# Altium project Current Sensor.PrjPCB
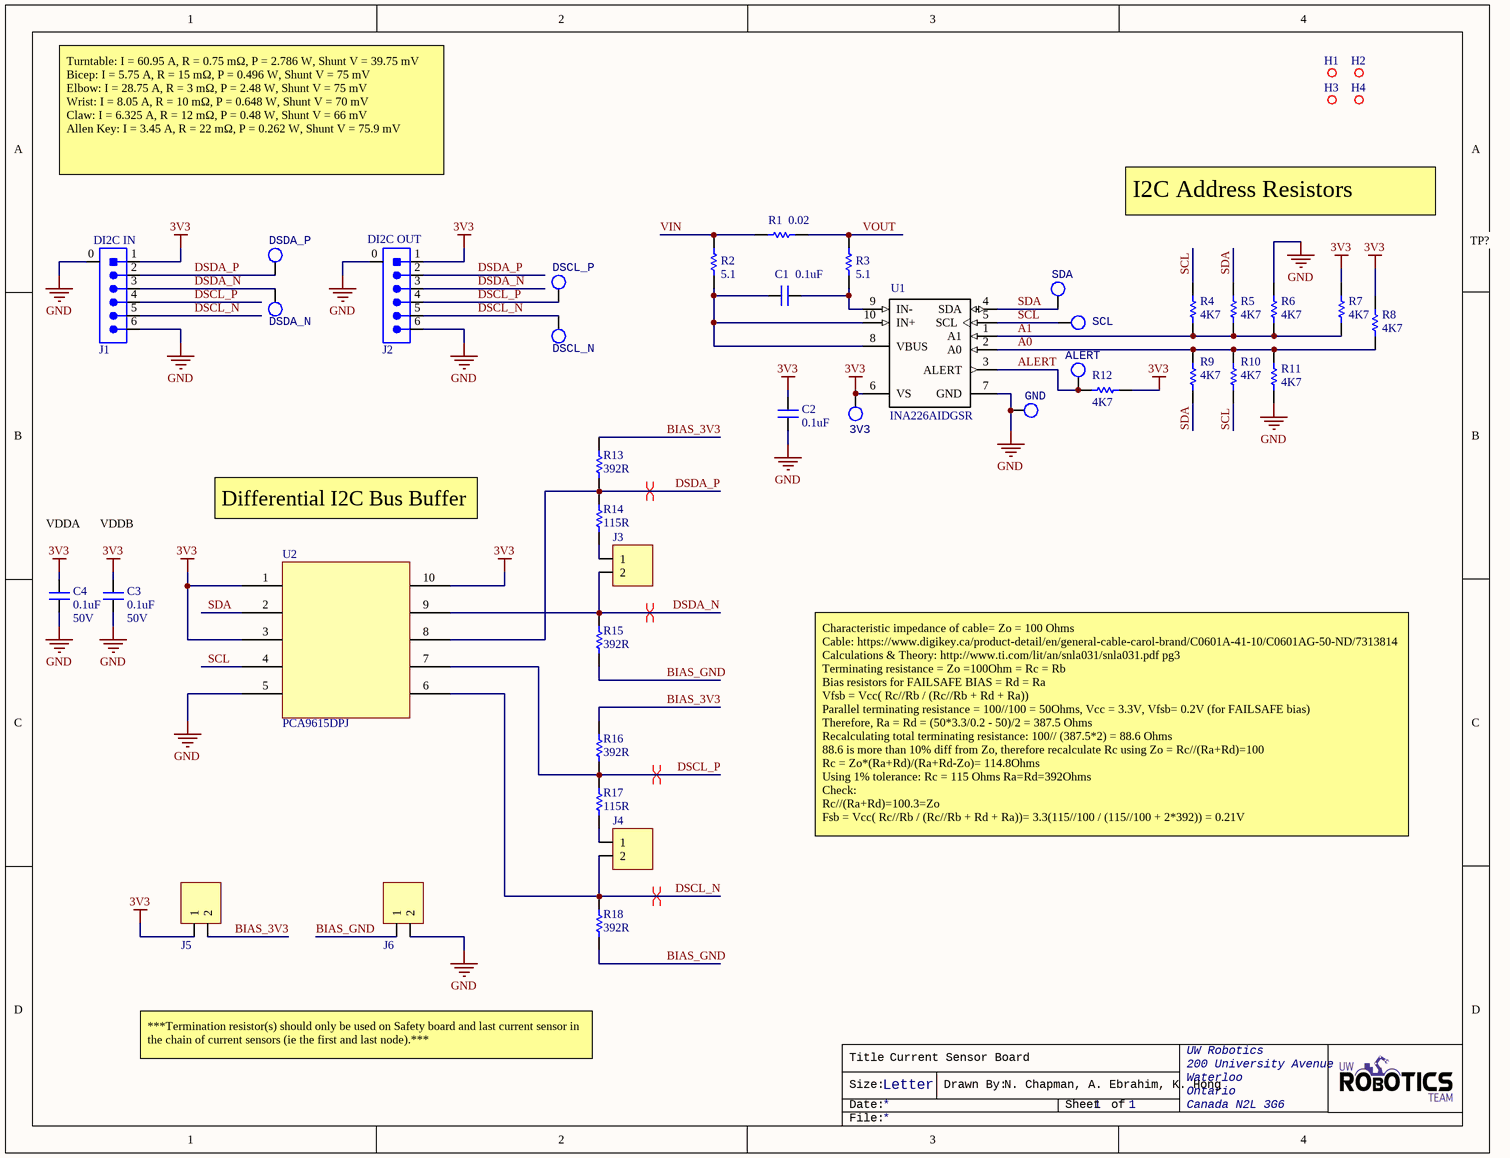
[diagram p0: Current Sensor.SchDoc]
Address1: 200 University Avenue; Address2: Waterloo; Address3: Ontario; Address4: Canada N2L 3G6; BoardName: Your Board Name; DrawnBy: Your Name
1 sheet, 43 parts. Net scope: global (net labels, ports and power ports of the same name join across sheets).
Board file: Current Sensor.PcbDoc

## Sheet Current Sensor.SchDoc: Current Sensor Board
size Letter; DrawnBy: N. Chapman, A. Ebrahim, K. Hong; Organization: UW Robotics; Address1: 200 University Avenue; Address2: Waterloo; Address3: Ontario; Address4: Canada N2L 3G6; Revision: A; SheetNumber: 1; SheetTotal: 1

### Parts
C1  value 0.1uF  [CAPC2012X140N]  (hidden comment: CAP_0.1uF_50V_0805)
C2  value 0.1uF  [CAPC2012X140N]  (hidden comment: CAP_0.1uF_50V_0805)
C3  value 0.1uF  Voltage Rating: 50V  [CAPC2012X140N]  (hidden comment: CAP_0.1uF_50V_0805)
C4  value 0.1uF  Voltage Rating: 50V  [CAPC2012X140N]  (hidden comment: CAP_0.1uF_50V_0805)
H1  MOUNTING_HOLES  [MOUNTING_HOLE]  (value not drawn)
H2  MOUNTING_HOLES  [MOUNTING_HOLE]  (value not drawn)
H3  MOUNTING_HOLES  [MOUNTING_HOLE]  (value not drawn)
H4  MOUNTING_HOLES  [MOUNTING_HOLE]  (value not drawn)
J1  DI2C IN  [MOLEX-5024940670]
J2  DI2C OUT  [MOLEX-5024940670]
J3  JUMPER_2  [HDR1X2]  (value not drawn)
J4  JUMPER_2  [HDR1X2]  (value not drawn)
J5  JUMPER_2  [HDR1X2]  (value not drawn)
J6  JUMPER_2  [HDR1X2]  (value not drawn)
R1  value 0.02  [RESC6532X75N]  (hidden comment: RES_20m_2512)
R2  value 5.1  [RESC2013X70X40LL20T20]  (hidden comment: RES_5.1_0805)
R3  value 5.1  [RESC2013X70X40LL20T20]  (hidden comment: RES_5.1_0805)
R4  value 4K7  [RESC2012X60N]  (hidden comment: RES_4K7_0805)
R5  value 4K7  [RESC2012X60N]  (hidden comment: RES_4K7_0805)
R6  value 4K7  [RESC2012X60N]  (hidden comment: RES_4K7_0805)
R7  value 4K7  [RESC2012X60N]  (hidden comment: RES_4K7_0805)
R8  value 4K7  [RESC2012X60N]  (hidden comment: RES_4K7_0805)
R9  value 4K7  [RESC2012X60N]  (hidden comment: RES_4K7_0805)
R10  value 4K7  [RESC2012X60N]  (hidden comment: RES_4K7_0805)
R11  value 4K7  [RESC2012X60N]  (hidden comment: RES_4K7_0805)
R12  value 4K7  [RESC2012X60N]  (hidden comment: RES_4K7_0805)
R13  Resistance: 392R  [RESC2012X60N]  (hidden comment: RES_392R_0805)
R14  Resistance: 115R  [RESC2012X60N]  (hidden comment: RES_115R_0805)
R15  Resistance: 392R  [RESC2012X60N]  (hidden comment: RES_392R_0805)
R16  Resistance: 392R  [RESC2012X60N]  (hidden comment: RES_392R_0805)
R17  Resistance: 115R  [RESC2012X60N]  (hidden comment: RES_115R_0805)
R18  Resistance: 392R  [RESC2012X60N]  (hidden comment: RES_392R_0805)
TP1  DSDA_P  [TESTPOINT_LOOP]
TP2  DSCL_P  [TESTPOINT_LOOP]
TP3  SDA  [TESTPOINT_LOOP]
TP4  DSDA_N  [TESTPOINT_LOOP]
TP5  SCL  [TESTPOINT_LOOP]
TP6  DSCL_N  [TESTPOINT_LOOP]
TP7  ALERT  [TESTPOINT_LOOP]
TP8  GND  [TESTPOINT_LOOP]
TP9  3V3  [TESTPOINT_LOOP]
U1  INA226AIDGSR  [INA226AIDGSR]
U2  DIFF_I2C_BUFFER  [PCA9615DPJ]  (value not drawn)

### Nets
3V3: C2.2 C3.2 C4.2 J1.1 J2.1 J5.1 R7.2 R8.2 R12.2 TP9.1 U1.6(VS) U2.1(VDDA) U2.3(EN) U2.10(VDDB)
GND: C2.1 C3.1 C4.1 J1.0 J1.6 J2.0 J2.6 J6.2 R6.2 R11.2 TP8.1 U1.7(GND) U2.5(VSS)
A0: R8.1 R9.1 R10.1 R11.1 U1.2(A0)
A1: R4.1 R5.1 R6.1 R7.1 U1.1(A1)
ALERT: R12.1 TP7.1 U1.3(ALERT)
BIAS_3V3: J5.2 R13.2 R16.2
BIAS_GND: J6.1 R15.1 R18.1
DSCL_N: J1.5 J2.5 J4.2 R18.2 TP6.1 U2.6(DSCLM)
DSCL_P: J1.4 J2.4 R16.1 R17.2 TP2.1 U2.7(DSCLP)
DSDA_N: J1.3 J2.3 J3.2 R15.2 TP4.1 U2.9(DSDAM)
DSDA_P: J1.2 J2.2 R13.1 R14.2 TP1.1 U2.8(DSDAP)
SCL: R4.2 R10.2 TP5.1 U1.5(SCL) U2.4(SCL)
SDA: R5.2 R9.2 TP3.1 U1.4(SDA) U2.2(SDA)
VIN: R1.1 R2.2
VOUT: R1.2 R3.2
NetC1_1: C1.1 R2.1 U1.8(VBUS) U1.10(IN+)
NetC1_2: C1.2 R3.1 U1.9(IN-)
NetJ3_1: J3.1 R14.1
NetJ4_1: J4.1 R17.1

### Layout directives
differential pair: DSCL_N, DSCL_P, DSDA_N, DSDA_P

### Notes on the sheet
- Turntable: I = 60.95 A, R = 0.75 mΩ, P = 2.786 W, Shunt V = 39.75 mV
  Bicep: I = 5.75 A, R = 15 mΩ, P = 0.496 W, Shunt V = 75 mV
  Elbow: I = 28.75 A, R = 3 mΩ, P = 2.48 W, Shunt V = 75 mV
  Wrist: I = 8.05 A, R = 10 mΩ, P = 0.648 W, Shunt V = 70 mV
  Claw: I = 6.325 A, R = 12 mΩ, P = 0.48 W, Shunt V = 66 mV
  Allen Key: I = 3.45 A, R = 22 mΩ, P = 0.262 W, Shunt V = 75.9 mV
- I2C Address Resistors
- TP?
- VDDA
- VDDB
- Differential I2C Bus Buffer
- Characteristic impedance of cable= Zo = 100 Ohms
  Cable: https://www.digikey.ca/product-detail/en/general-cable-carol-brand/C0601A-41-10/C0601AG-50-ND/7313814
  Calculations & Theory: http://www.ti.com/lit/an/snla031/snla031.pdf pg3
  Terminating resistance = Zo =100Ohm = Rc = Rb
  Bias resistors for FAILSAFE BIAS = Rd = Ra
  Vfsb = Vcc( Rc//Rb / (Rc//Rb + Rd + Ra))
  Parallel terminating resistance = 100//100 = 50Ohms, Vcc = 3.3V, Vfsb= 0.2V (for FAILSAFE bias)
  Therefore, Ra = Rd = (50*3.3/0.2 - 50)/2 = 387.5 Ohms
  Recalculating total terminating resistance: 100// (387.5*2) = 88.6 Ohms
  88.6 is more than 10% diff from Zo, therefore recalculate Rc using Zo = Rc//(Ra+Rd)=100
  Rc = Zo*(Ra+Rd)/(Ra+Rd-Zo)= 114.8Ohms
  Using 1% tolerance: Rc = 115 Ohms Ra=Rd=392Ohms
  Check:
  Rc//(Ra+Rd)=100.3=Zo
  Fsb = Vcc( Rc//Rb / (Rc//Rb + Rd + Ra))= 3.3(115//100 / (115//100 + 2*392)) = 0.21V
- ***Termination resistor(s) should only be used on Safety board and last current sensor in the chain of current sensors (ie the first and last node).***
- Title
- Size:
- Date:
- Letter
- Drawn By:
- Sheet
- of
- File:

### Library data of the parts
C1 C2 = CAP_0.1uF_50V_0805: CAP CER 0.1UF 50V X7R 0805; Manufacturer 1: Murata; Manufacturer Part Number 1: GCD21BR71H104KA01L; Capacitance: 100nF; Tolerance: 10%; Supplier 1: Digi-Key; Mount: Surface Mount; Case/Package: 0805; Case Code (Metric): 2012; Case Code (Imperial): 0805; Min Operating Temperature: -55°C; Max Operating Temperature: 125°C; Voltage Rating: 50V; Dielectric: X7R; Termination: SMD/SMT; Length: 2mm; Height: 1.25mm; Width: 0.049inch; Thickness: 0.049inch; Depth: 1.25mm; Ratings: AEC-Q200; ComponentLink1URL: https://datasheet.ciiva.com/29537/c03e-29537701.pdf?src-supplier=Digi-Key; ComponentLink1Description: https://datasheet.ciiva.com/29537/c03e-29537701.pdf?src-supplier=Digi-Key; Supplier Part Number 1: 490-11955-1-ND
C3 C4 = CAP_0.1uF_50V_0805: CAP CER 0.1UF 50V X7R 0805; Manufacturer 1: Murata Electronics; Manufacturer Part Number 1: GCD21BR71H104KA01L; Capacitance: 100nF; Tolerance: 10%; Supplier 1: Digi-Key; Mount: Surface Mount; Case/Package: 0805; Case Code (Metric): 2012; Case Code (Imperial): 0805; Min Operating Temperature: -55°C; Max Operating Temperature: 125°C; Dielectric: X7R; Termination: SMD/SMT; Length: 2mm; Height: 1.25mm; Width: 0.049inch; Thickness: 0.049inch; Depth: 1.25mm; Ratings: AEC-Q200; ComponentLink1URL: https://datasheet.ciiva.com/29537/c03e-29537701.pdf?src-supplier=Digi-Key; ComponentLink1Description: https://datasheet.ciiva.com/29537/c03e-29537701.pdf?src-supplier=Digi-Key; Supplier Part Number 1: 490-11955-1-ND
H1-H4 = MOUNTING_HOLES: 6cm x 6cm
J1 J2 = CON_6M_SM_RA: CONN HEADER SMD RIGHT ANGLE 2MM PITCH; Manufacturer 1: Molex; Manufacturer Part Number 1: 502494-0670; Insulation Resistance: 1GR; Current Rating: 3A; Voltage Rating: 250V; Connector Type: Receptacle,Forked; Number of Positions: 6; Gender: Receptacle; Glow Wire Compliant: Non-compliant; Supplier 1: Digi-Key; Stock 1: 7093; Pricing 1: 1=0.81000, 10=0.70800, 25=0.66680, 50=0.63880, 100=0.61110, 250=0.55552 (USD); RoHS: Yes; Mount: Surface Mount; Material: Polybutylene; Color: Natural; Housing Material: PBT; Housing Color: Natural; Contact Plating: Tin; Contact Material: Copper Alloy; Min Operating Temperature: -25°C; Max Operating Temperature: 85°C; Package Quantity: 950; Number of Rows: 1; Fastening Type: Latch; Packaging: Tape and Reel; Termination: Solder; Number of Contacts: 6; Orientation: Right Angle; Number of Circuits: 6; Contact Gender: Female; Max Voltage Rating (AC): 250V; Max Voltage Rating (DC): 250V; Length: 16mm; Pitch: 2mm; Depth: 6.85mm; Radiation Hardening: No; REACH SVHC: Unknown; Flammability Rating: UL94 V-0; ComponentLink1URL: https://datasheet.ciiva.com/755/5024940670-sd-755844.pdf?src-supplier=Digi-Key; ComponentLink1Description: https://datasheet.ciiva.com/755/5024940670-sd-755844.pdf?src-supplier=Digi-Key; ComponentLink2URL: https://datasheet.ciiva.com/24467/101355024940670-pcb-receptacles-24467588.pdf?src-supplier=Onlinecomponents.com; ComponentLink2Description: https://datasheet.ciiva.com/24467/101355024940670-pcb-receptacles-24467588.pdf?src-supplier=Onlinecomponents.com; ComponentLink3URL: https://datasheet.ciiva.com/16656/5024940670-pcb-receptacles-16656439.pdf?src-supplier=Avnet+Europe; ComponentLink3Description: https://datasheet.ciiva.com/16656/5024940670-pcb-receptacles-16656439.pdf?src-supplier=Avnet+Europe; ComponentLink4URL: https://datasheet.ciiva.com/7436/1630854-7436283.pdf?src-supplier=Newark; ComponentLink4Description: https://datasheet.ciiva.com/7436/1630854-7436283.pdf?src-supplier=Newark; ComponentLink5URL: https://datasheet.ciiva.com/5157/5024940670-pcb-receptacles-179322-5157180.pdf?src-supplier=Mouser; ComponentLink5Description: https://datasheet.ciiva.com/5157/5024940670-pcb-receptacles-179322-5157180.pdf?src-supplier=Mouser; ComponentLink6URL: https://datasheet.ciiva.com/7917/1630854-7917014.pdf?src-supplier=Element14; ComponentLink6Description: https://datasheet.ciiva.com/7917/1630854-7917014.pdf?src-supplier=Element14; ComponentLink7URL: https://datasheet.ciiva.com/30242/101355024940670-pcb-receptacles-30242550.pdf?src-supplier=Onlinecomponents.com; ComponentLink7Description: https://datasheet.ciiva.com/30242/101355024940670-pcb-receptacles-30242550.pdf?src-supplier=Onlinecomponents.com; ComponentLink8URL: https://datasheet.ciiva.com/755/5024940670-sd-755789.pdf?src-supplier=Digi-Key; ComponentLink8Description: https://datasheet.ciiva.com/755/5024940670-sd-755789.pdf?src-supplier=Digi-Key; Supplier Part Number 1: WM2283CT-ND
J3-J6 = JUMPER_2: HEADER 2X1; Manufacturer 1: TE Connectivity; Manufacturer Part Number 1: 87220-2; Supplier 1: Digi-Key; Supplier Part Number 1: A26542-ND; Mount: Through Hole
R1 = RES_20m_2512: RES 0.02 OHM 1% 3W 2512; Manufacturer 1: Riedon; Manufacturer Part Number 1: CSRL3-0R02F8; Supplier 1: Digi-Key; Pricing 1: 1=0.66000, 10=0.47400, 25=0.36920, 50=0.31260, 100=0.24620, 250=0.20836, 500=0.17048, 1000=0.13259 (USD); RoHS: No; Supplier Part Number 1: 696-1840-1-ND
R2 R3 = RES_5.1_0805: RES SMD 5.1 OHM 5% 1/8W 0805; Part Number: ERJ-6GEYJ5R1V; Manufacturer: Panasonic; Supplier 1: Digi-Key; Supplier Part Number 1: P5.1ACT-ND
R4-R12 = RES_4K7_0805: RES SMD 4.7K OHM 5% 1/8W 0805; Manufacturer 1: Yageo; Manufacturer Part Number 1: RC0805JR-074K7L; Resistance: 4.7kR; Temperature Coefficient: 100ppm/°C; Power Rating: 125mW; Voltage Rating: 150V; Supplier 1: Digi-Key; Stock 1: 2755291; Pricing 1: 1=0.10000, 10=0.03500, 100=0.01400, 1000=0.00631, 2500=0.00548 (USD); RoHS: Yes; Case/Package: Molded; Contact Plating: Tin,Lead,Matte; Case Code (Imperial): 0805; Case Code (Metric): 2012; Min Operating Temperature: -55°C; Max Operating Temperature: 155°C; Tolerance: 5%; Packaging: Tape and Reel; Composition: Thick Film; Termination: SMD/SMT; Military Standard: Not; Length: 2mm; Depth: 1.25mm; Radiation Hardening: No; REACH SVHC: Unknown; Lead Free: Lead Free; ComponentLink1URL: https://datasheet.ciiva.com/7941/442941-7941973.pdf?src-supplier=Element14; ComponentLink1Description: https://datasheet.ciiva.com/7941/442941-7941973.pdf?src-supplier=Element14; ComponentLink2URL: https://datasheet.ciiva.com/7941/442941-7941974.pdf?src-supplier=Element14; ComponentLink2Description: https://datasheet.ciiva.com/7941/442941-7941974.pdf?src-supplier=Element14; ComponentLink3URL: https://datasheet.ciiva.com/17486/rc0805-17486827.pdf?src-supplier=Future+Electronics; ComponentLink3Description: https://datasheet.ciiva.com/17486/rc0805-17486827.pdf?src-supplier=Future+Electronics; ComponentLink4URL: https://datasheet.ciiva.com/12667/rc0805-12667037.pdf?src-supplier=Mouser; ComponentLink4Description: https://datasheet.ciiva.com/12667/rc0805-12667037.pdf?src-supplier=Mouser; Supplier Part Number 1: 311-4.7KARCT-ND
R13 R15 R16 R18 = RES_392R_0805: RES SMD 392 OHM 1% 1/8W 0805; Manufacturer 1: Yageo; Manufacturer Part Number 1: RC0805FR-07392RL; Max Power Dissipation: 125mW; Temperature Coefficient: 100ppm/°C; Voltage Rating (DC): 150V; Case Code (Imperial): 0805; Case Code (Metric): 2012; Case/Package: 0805; Category: Chip SMD Resistors; Composition: Thick Film; Depth: 1.25mm; Features: Moisture Resistant; Height: 0.024inch; Military Standard: Not; Max Operating Temperature: 155°C; Manufacturer Part Number: RC0805FR-07392RL; Length: 0.079inch; Lead Free: Lead Free; Min Operating Temperature: -55°C; Number of Terminations: 2; Package Quantity: 1; Packaging: Tape and Reel; Power Rating: 125mW; Tolerance: 1%; Width: 0.049inch; Supplier 1: Digi-Key; Supplier Part Number 1: 311-392CRCT-ND; Supplier Packaging 1: Cut Tape; Supplier Unit Price 1: 0.15 CAD; Supplier Location 1: US
R14 R17 = RES_115R_0805: RES SMD 115 OHM 1% 1/8W 0805; Manufacturer 1: Yageo; Manufacturer Part Number 1: RC0805FR-07115RL; Max Power Dissipation: 125mW; Temperature Coefficient: 100ppm/°C; Voltage Rating (DC): 150V; Case Code (Imperial): 0805; Case Code (Metric): 2012; Case/Package: 0805; Category: Chip SMD Resistors; Composition: Thick Film; Depth: 1.25mm; Features: Moisture Resistant; Height: 0.024inch; Military Standard: Not; Max Operating Temperature: 155°C; Manufacturer Part Number: RC0805FR-07115RL; Length: 0.079inch; Lead Free: Lead Free; Min Operating Temperature: -55°C; Number of Terminations: 2; Package Quantity: 1; Packaging: Tape and Reel; Power Rating: 125mW; Tolerance: 1%; Width: 0.049inch; Supplier 1: Digi-Key; Supplier Part Number 1: 311-115CRCT-ND; Supplier Packaging 1: Cut Tape; Supplier Unit Price 1: 0.14476 CAD; Supplier Location 1: US
TP1 TP2 TP4 TP6 = TESTPOINT_LOOP: Loop testpoint through-hole pad; Manufacturer 1: Keystone Electronics; Manufacturer Part Number 1: 5002; Supplier Part Number 1: 36-5002-ND; Supplier 1: Digi-Key; Mount: Through Hole
TP3 TP5 TP7-TP9 = TESTPOINT_LOOP: Loop testpoint through-hole pad; Manufacturer: Keystone Electronics; Manufacturer Part Number 1: 5002; Supplier Part Number 1: 36-5002-ND; Supplier 1: Digi-Key
U1 = INA226AIDGSR: IC MONITOR PWR/CURR BIDIR 10MSOP; MF: Texas Instruments; Availability: Unavailable; Package: MSOP-10 Texas Instruments; Price: None; SnapEDA_Link: https://www.snapeda.com/parts/INA226AIDGSR/Texas%20Instruments/view-part/53552/?ref=snap; MP: INA226AIDGSR; Supplier 1: Digi-Key; Supplier Part Number 1: 296-29034-6-ND
U2 = DIFF_I2C_BUFFER: IC DIFF I2C BUFFER 2CH 10TSSOP; Manufacturer 1: NXP Semiconductors; Number of Channels: 2; Operating Supply Current: 16uA; Input: 2-Wire Bus; Max Frequency: 1MHz; Supplier 1: Digi-Key; Stock 1: 4899; Pricing 1: 1=2.95000, 10=2.64900, 100=2.05930, 500=1.78100, 1000=1.48045 (USD); RoHS: Yes; Case/Package: 10-TSSOP; Number of Pins: 10; Min Operating Temperature: -40°C; Max Operating Temperature: 85°C; Packaging: Cut Tape; Package Quantity: 1; ComponentLink1URL: http://www.farnell.com/datasheets/2340284.pdf?src-supplier=Farnell; ComponentLink1Description: http://www.farnell.com/datasheets/2340284.pdf?src-supplier=Farnell; ComponentLink2URL: http://www.mouser.com/ds/2/302/PCA9615-841773.pdf?src-supplier=Mouser; ComponentLink2Description: http://www.mouser.com/ds/2/302/PCA9615-841773.pdf?src-supplier=Mouser; ComponentLink3URL: http://components.arrow.com/part/dataview/65281105S797392N7788?src-supplier=Arrow; ComponentLink3Description: http://components.arrow.com/part/dataview/65281105S797392N7788?src-supplier=Arrow; ComponentLink4URL: http://www.nxp.com/documents/data_sheet/PCA9615.pdf?src-supplier=Avnet; ComponentLink4Description: http://www.nxp.com/documents/data_sheet/PCA9615.pdf?src-supplier=Avnet; ComponentLink5Description: Digikey Link; ComponentLink5URL: https://www.digikey.ca/products/en/integrated-circuits-ics/interface-signal-buffers-repeaters-splitters/756?k=PCA9615&k=&pkeyword=PCA9615&sv=0&pv7=2&sf=0&FV=-8%7C756&quantity=&ColumnSort=0&page=1&pageSize=25; Supplier Part Number 1: 568-11484-1-ND; Mount: Surface Mount; Manufacturer Part Number 1: PCA9615DPJ